# EAGLE schematic Spark-power-meter-main (EAGLE 7.2.0)
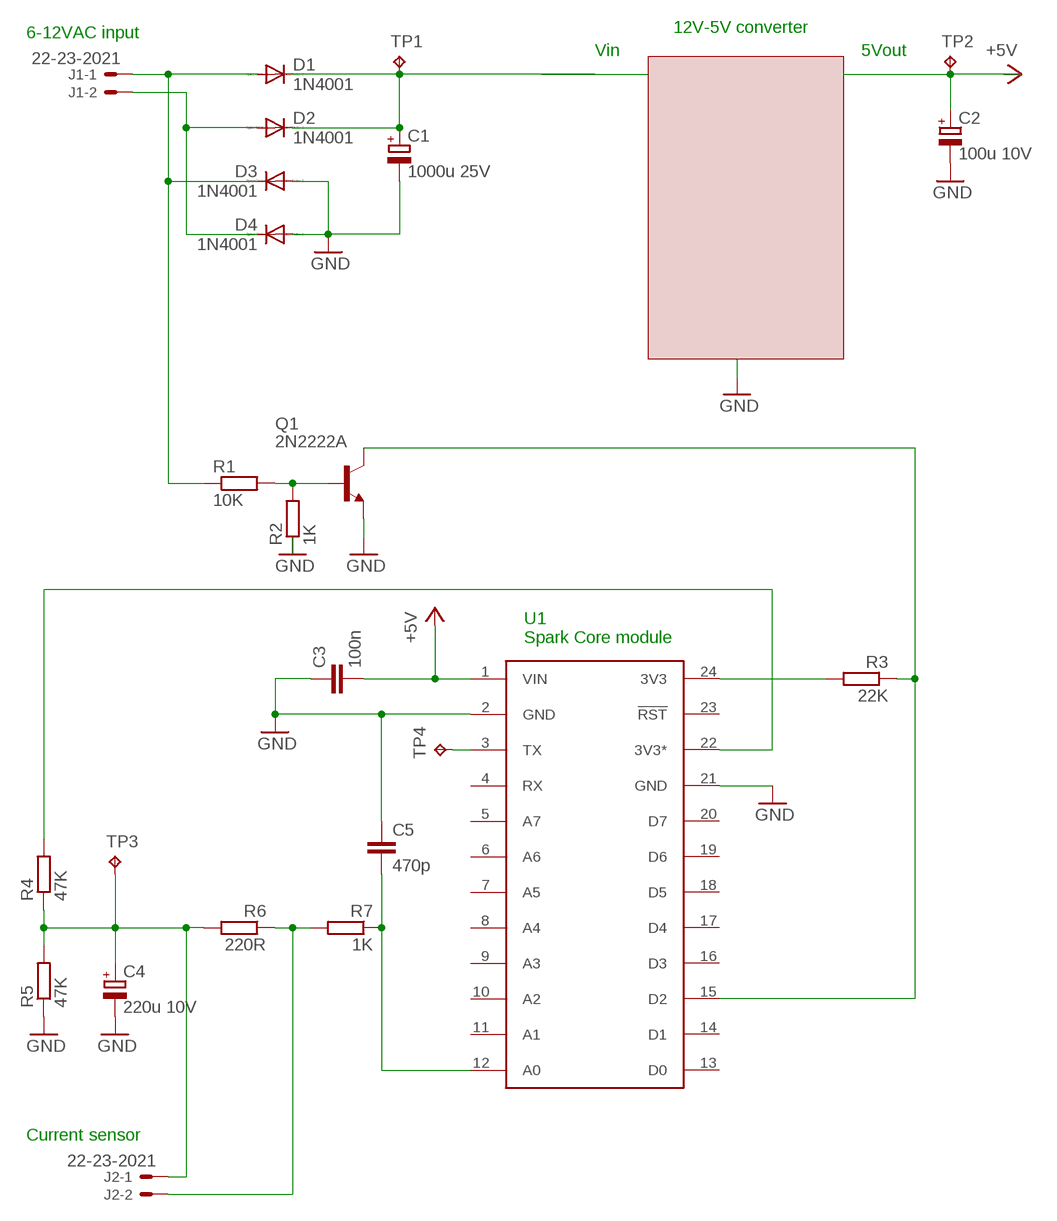
[diagram p0: schematic, sheet 1]

## Parts
C1  1000u 25V  CPOL-EUE5-9VAXIAL  [E5R]
C2  100u 10V  CPOL-EUE5-9VAXIAL  [E5R]
C3  100n  C-EU075-032X103  [C075-032X103]
C4  220u 10V  CPOL-EUE5-9VAXIAL  [E5R]
C5  470p  C-EU075-032X103  [C075-032X103]
D1  1N4001  1N4004  [DO41-10]
D2  1N4001  1N4004  [DO41-10]
D3  1N4001  1N4004  [DO41-10]
D4  1N4001  1N4004  [DO41-10]
J1  22-23-2021  [22-23-2021]
J2  22-23-2021  [22-23-2021]
Q1  2N2222A  [TO18]
R1  10K  R-EU_0207/10  [0207/10]
R2  1K  R-EU_0207/10  [0207/10]
R3  22K  R-EU_0207/10  [0207/10]
R4  47K  R-EU_0207/10  [0207/10]
R5  47K  R-EU_0207/10  [0207/10]
R6  220R  R-EU_0207/10  [0207/10]
R7  1K  R-EU_0207/10  [0207/10]
TP1  TPB1,27  [B1,27]
TP2  TPB1,27  [B1,27]
TP3  TPB1,27  [B1,27]
TP4  TPB1,27  [B1,27]
U$1  SPARK_CORECORE  [SPARK_CORE]

## Nets
+5V: C2.+ C3.2 TP2.TP U$1.1(VIN)
+12V: C1.+ D1.C D2.C TP1.TP
GND: C1.- C2.- C3.1 C4.- C5.1 D3.A D4.A Q1.1(E) R2.1 R5.1 U$1.2(GND) U$1.21(GND)
N$1: D1.A D3.C J1.1 R1.1
N$2: D2.A D4.C J1.2
N$3: Q1.2(B) R1.2 R2.2
N$4: Q1.3(C) R3.1 U$1.15(D2)
N$5: R3.2 U$1.24(3V3)
N$6: R4.2 U$1.22(3V3*)
N$7: C4.+ J2.1 R4.1 R5.2 R6.2 TP3.TP
N$8: TP4.TP U$1.3(TX)
N$9: C5.2 R7.1 U$1.12(A0)
N$10: J2.2 R6.1 R7.2
Unconnected: U$1.4(RX) U$1.5(A7) U$1.6(A6) U$1.7(A5) U$1.8(A4) U$1.9(A3) U$1.10(A2) U$1.11(A1) U$1.13(D0) U$1.14(D1) U$1.16(D3) U$1.17(D4) U$1.18(D5) U$1.19(D6) U$1.20(D7) U$1.23(!RST)

## Notes on the sheet
- 12V-5V converter
- 6-12VAC input
- Vin | 5Vout
- U1
  Spark Core module
- Current sensor

## Library data of the parts
C1 C2 C4 = rcl:CPOL-EU: POLARIZED CAPACITOR, European symbol
C3 C5 = rcl:C-EU: CAPACITOR, European symbol
D1-D4 = diode:1N4004: DIODE general purpose rectifier, 1 A
J1 J2 = con-molex:22-23-2021: .100" (2.54mm) Center Header - 2 Pin; MF: MOLEX; MPN: 22-23-2021; OC_FARNELL: 1462926; OC_NEWARK: 25C3832
Q1 = transistor-npn:2N2222*: NPN Transistor
R1-R7 = resistor:R-EU_: RESISTOR, European symbol
TP1-TP4 = testpad:TP: Test pad
U$1 = Spark:SPARK_CORE